# EAGLE design stm_adapters (EAGLE 7.4.0)
STM32 development boards
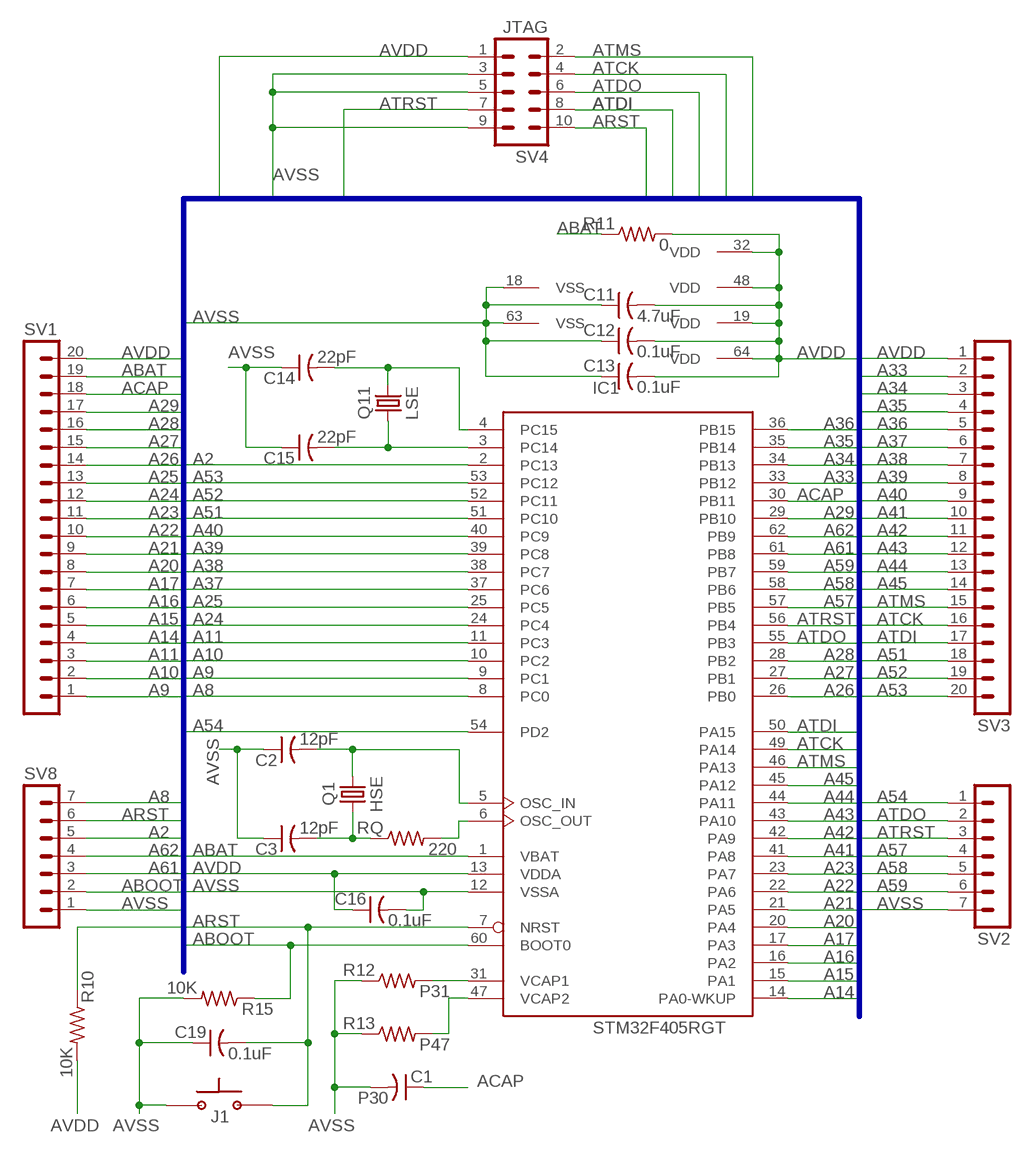
[diagram p0: schematic, sheet 1, part 1 of 2]
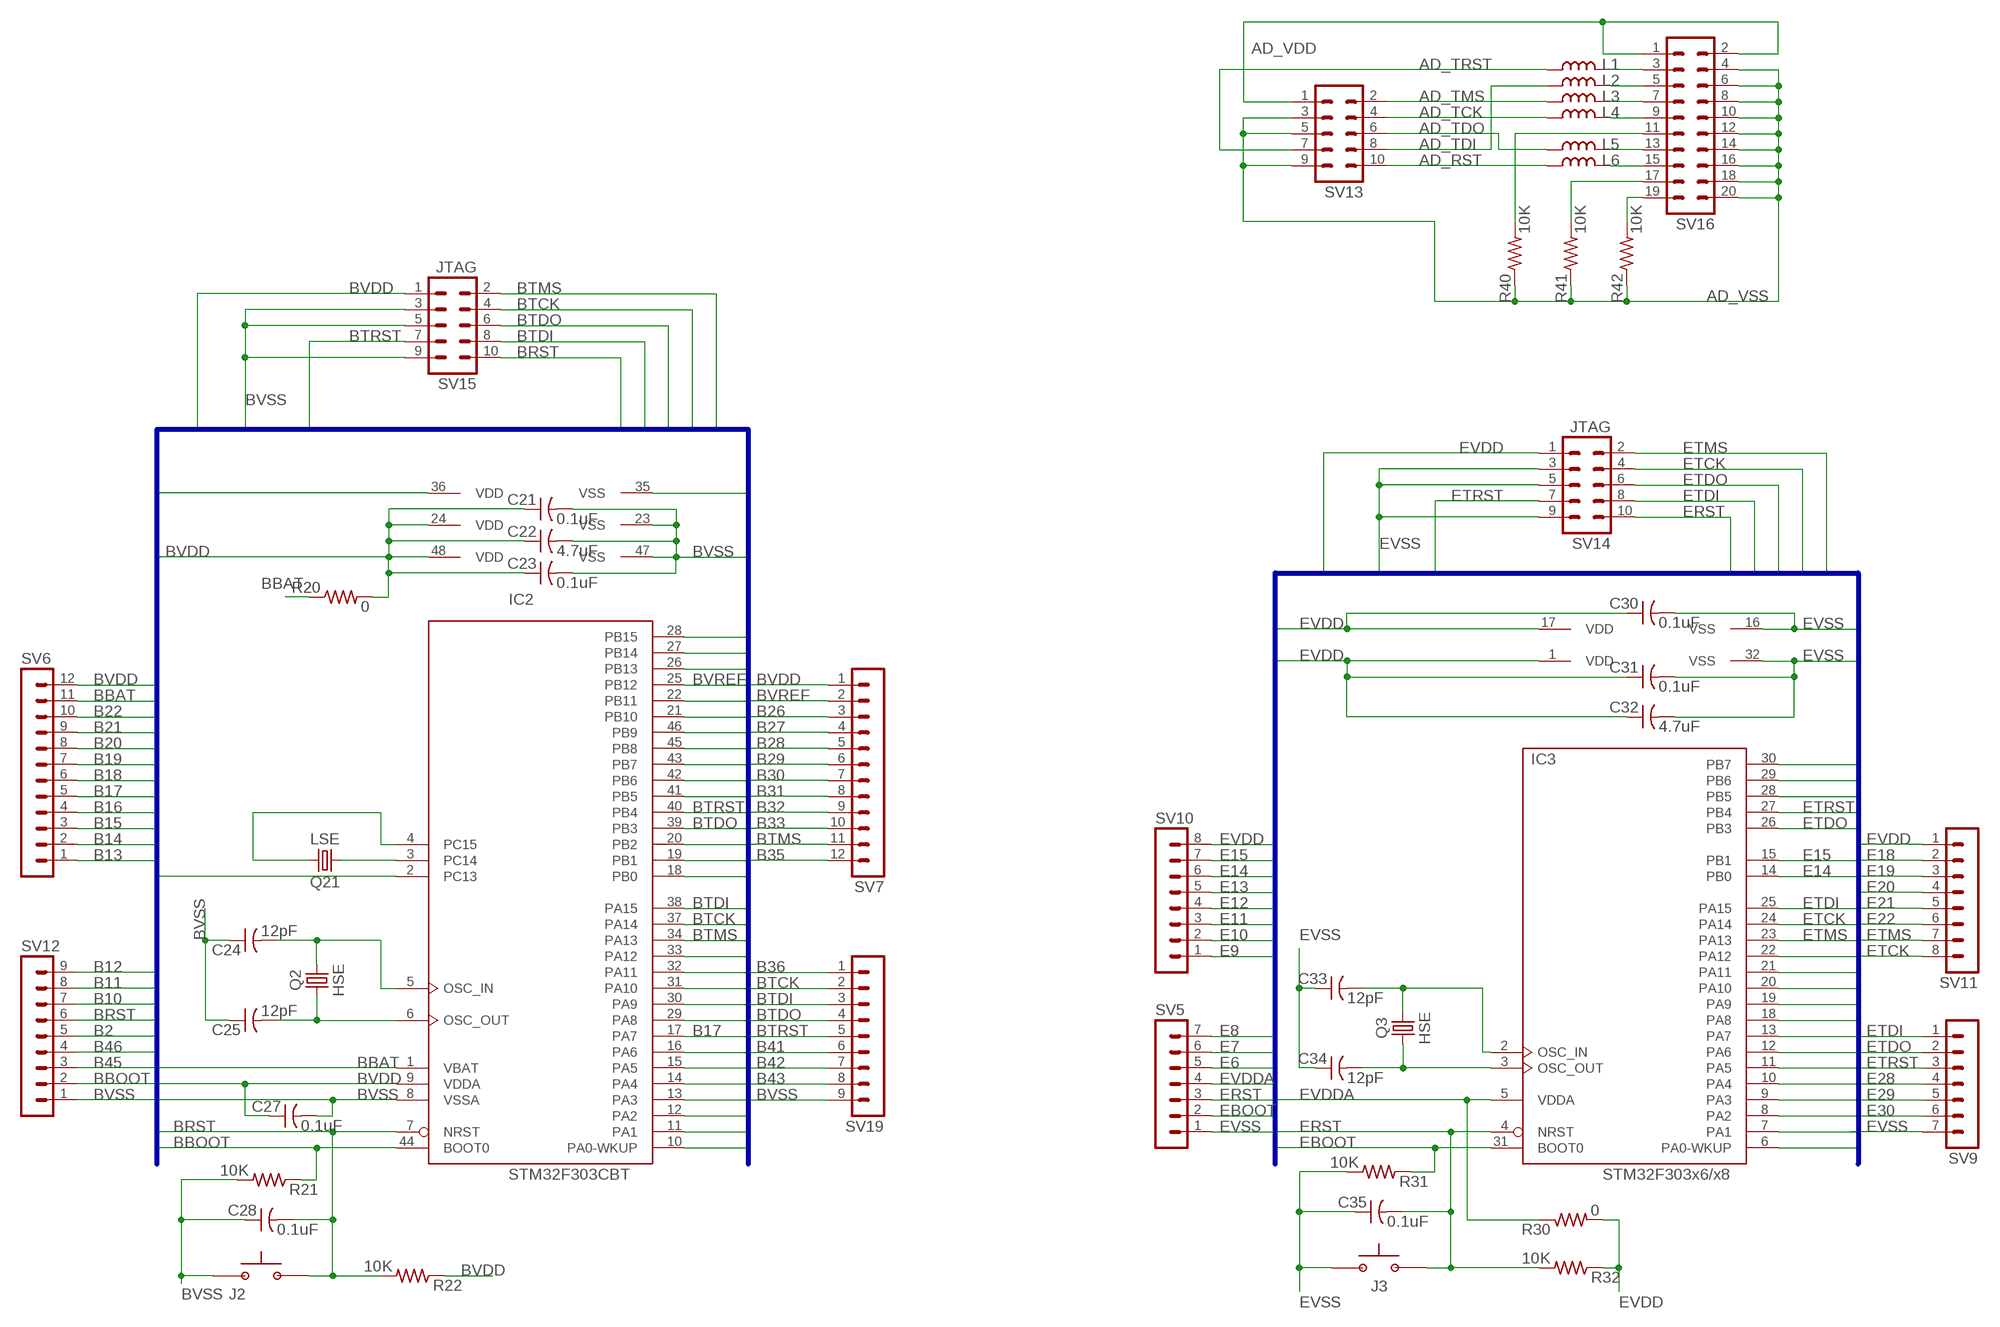
[diagram p1: schematic, sheet 1, part 2 of 2]

## Parts
C1  P30  C-US0805  [C0805]
C2  12pF  C-US0805  [C0805]
C3  12pF  C-US0805  [C0805]
C11  4.7uF  C-US0805  [C0805]
C12  0.1uF  C-US0805  [C0805]
C13  0.1uF  C-US0805  [C0805]
C14  22pF  C-US0805  [C0805]
C15  22pF  C-US0805  [C0805]
C16  0.1uF  C-US0805  [C0805]
C19  0.1uF  C-US0805  [C0805]
C21  0.1uF  C-US0805  [C0805]
C22  4.7uF  C-US0805  [C0805]
C23  0.1uF  C-US0805  [C0805]
C24  12pF  C-US0805  [C0805]
C25  12pF  C-US0805  [C0805]
C27  0.1uF  C-US0805  [C0805]
C28  0.1uF  C-US0805  [C0805]
C30  0.1uF  C-US0805  [C0805]
C31  0.1uF  C-US0805  [C0805]
C32  4.7uF  C-US0805  [C0805]
C33  12pF  C-US0805  [C0805]
C34  12pF  C-US0805  [C0805]
C35  0.1uF  C-US0805  [C0805]
IC1  STM32F405RGT  [LQFP64]
IC2  STM32F303CBT  [LQFP48]
IC3  STM32F303x6/x8  STM32F051K4T  [LQFP32]
J1  BUTTON-FSM14JRT  [BUTTON-FSM14JRT]
J2  BUTTON-FSM14JRT  [BUTTON-FSM14JRT]
J3  BUTTON-FSM14JRT  [BUTTON-FSM14JRT]
L1  L-USL0603  [L0603]
L2  L-USL0603  [L0603]
L3  L-USL0603  [L0603]
L4  L-USL0603  [L0603]
L5  L-USL0603  [L0603]
L6  L-USL0603  [L0603]
Q1  HSE  Q-HSEHC-46X  [Q-HC-46X]
Q2  HSE  Q-HSEHC-46X  [Q-HC-46X]
Q3  HSE  Q-HSEHC-46X  [Q-HC-46X]
Q11  LSE  Q-LSEMC-306  [Q-MC-306]
Q21  LSE  Q-LSEMC-306  [Q-MC-306]
R10  10K  R-US0805  [R0805]
R11  0  R-US0805  [R0805]
R12  P31  R-US0805  [R0805]
R13  P47  R-US0805  [R0805]
R15  10K  R-US0805  [R0805]
R20  0  R-US0805  [R0805]
R21  10K  R-US0805  [R0805]
R22  10K  R-US0805  [R0805]
R30  0  R-US0805  [R0805]
R31  10K  R-US0805  [R0805]
R32  10K  R-US0805  [R0805]
R40  10K  R-US0805  [R0805]
R41  10K  R-US0805  [R0805]
R42  10K  R-US0805  [R0805]
RQ  220  R-US0805  [R0805]
SV1  MA20-1NO-PL  [MA20-1-NO-PL]
SV2  MA07-1NO-PL  [MA07-1-NO-PL]
SV3  MA20-1NO-PL  [MA20-1-NO-PL]
SV4  JTAG  MA05-2  [MA05-2]
SV5  MA07-1NO-PL  [MA07-1-NO-PL]
SV6  MA12-1NO-PL  [MA12-1-NO-PL]
SV7  MA12-1NO-PL  [MA12-1-NO-PL]
SV8  MA07-1NO-PL  [MA07-1-NO-PL]
SV9  MA07-1NO-PL  [MA07-1-NO-PL]
SV10  MA08-1NO-PL  [MA08-1-NO-PL]
SV11  MA08-1NO-PL  [MA08-1-NO-PL]
SV12  MA09-1NO-PL  [MA09-1-NO-PL]
SV13  MA05-2  [MA05-2]
SV14  JTAG  MA05-2  [MA05-2]
SV15  JTAG  MA05-2  [MA05-2]
SV16  MA10-2  [MA10-2]
SV19  MA09-1NO-PL  [MA09-1-NO-PL]

## Nets
A2: IC1.2(PC13) SV8.5
A8: IC1.8(PC0) SV8.7
A9: IC1.9(PC1) SV1.1
A10: IC1.10(PC2) SV1.2
A11: IC1.11(PC3) SV1.3
A14: IC1.14(PA0-WKUP) SV1.4
A15: IC1.15(PA1) SV1.5
A16: IC1.16(PA2) SV1.6
A17: IC1.17(PA3) SV1.7
A20: IC1.20(PA4) SV1.8
A21: IC1.21(PA5) SV1.9
A22: IC1.22(PA6) SV1.10
A23: IC1.23(PA7) SV1.11
A24: IC1.24(PC4) SV1.12
A25: IC1.25(PC5) SV1.13
A26: IC1.26(PB0) SV1.14
A27: IC1.27(PB1) SV1.15
A28: IC1.28(PB2) SV1.16
A29: IC1.29(PB10) SV1.17
A33: IC1.33(PB12) SV3.2
A34: IC1.34(PB13) SV3.3
A35: IC1.35(PB14) SV3.4
A36: IC1.36(PB15) SV3.5
A37: IC1.37(PC6) SV3.6
A38: IC1.38(PC7) SV3.7
A39: IC1.39(PC8) SV3.8
A40: IC1.40(PC9) SV3.9
A41: IC1.41(PA8) SV3.10
A42: IC1.42(PA9) SV3.11
A43: IC1.43(PA10) SV3.12
A44: IC1.44(PA11) SV3.13
A45: IC1.45(PA12) SV3.14
A51: IC1.51(PC10) SV3.18
A52: IC1.52(PC11) SV3.19
A53: IC1.53(PC12) SV3.20
A54: IC1.54(PD2) SV2.1
A57: IC1.57(PB5) SV2.4
A58: IC1.58(PB6) SV2.5
A59: IC1.59(PB7) SV2.6
A61: IC1.61(PB8) SV8.3
A62: IC1.62(PB9) SV8.4
ABAT: IC1.1(VBAT) R11.1 SV1.19
ABOOT: IC1.60(BOOT0) R15.1 SV8.2
ACAP: C1.1 IC1.30(PB11) SV1.18
ACAP1: IC1.31(VCAP1) R12.2
ACAP2: IC1.47(VCAP2) R13.2
AD_RST: L6.1 SV13.10
AD_TCK: L4.1 SV13.4
AD_TDI: L2.1 SV13.8
AD_TDO: L5.1 SV13.6
AD_TMS: L3.1 SV13.2
AD_TRST: L1.1 SV13.7
AD_VDD: SV13.1 SV16.1 SV16.2
AD_VSS: R40.1 R41.1 R42.1 SV13.3 SV13.5 SV13.9 SV16.4 SV16.6 SV16.8 SV16.10 SV16.12 SV16.14 SV16.16 SV16.18 SV16.20
ARST: C19.2 IC1.7(NRST) J1.P$2 R10.1 SV4.10 SV8.6
ATCK: IC1.49(PA14) SV3.16 SV4.4
ATDI: IC1.50(PA15) SV3.17 SV4.8
ATDO: IC1.55(PB3) SV2.2 SV4.6
ATMS: IC1.46(PA13) SV3.15 SV4.2
ATRST: IC1.56(PB4) SV2.3 SV4.7
AVDD: C11.2 C12.2 C13.2 C16.1 IC1.13(VDDA) IC1.19(VDD) IC1.32(VDD) IC1.48(VDD) IC1.64(VDD) R10.2 R11.2 SV1.20 SV3.1 SV4.1
AVSS: C1.2 C2.1 C3.1 C11.1 C12.1 C13.1 C14.1 C15.1 C16.2 C19.1 IC1.12(VSSA) IC1.18(VSS) IC1.63(VSS) J1.P$1 R12.1 R13.1 R15.2 SV2.7 SV4.3 SV4.5 SV4.9 SV8.1
B2: IC2.2(PC13) SV12.5
B10: IC2.10(PA0-WKUP) SV12.7
B11: IC2.11(PA1) SV12.8
B12: IC2.12(PA2) SV12.9
B13: IC2.13(PA3) SV6.1
B14: IC2.14(PA4) SV6.2
B15: IC2.15(PA5) SV6.3
B16: IC2.16(PA6) SV6.4
B17: IC2.17(PA7) SV6.5
B18: IC2.18(PB0) SV6.6
B19: IC2.19(PB1) SV6.7
B20: IC2.20(PB2) SV6.8
B21: IC2.21(PB10) SV6.9
B22: IC2.22(PB11) SV6.10
B26: IC2.26(PB13) SV7.3
B27: IC2.27(PB14) SV7.4
B28: IC2.28(PB15) SV7.5
B29: IC2.29(PA8) SV7.6
B30: IC2.30(PA9) SV7.7
B31: IC2.31(PA10) SV7.8
B32: IC2.32(PA11) SV7.9
B33: IC2.33(PA12) SV7.10
B35: IC2.35(VSS) SV7.12
B36: IC2.36(VDD) SV19.1
B41: IC2.41(PB5) SV19.6
B42: IC2.42(PB6) SV19.7
B43: IC2.43(PB7) SV19.8
B45: IC2.45(PB8) SV12.3
B46: IC2.46(PB9) SV12.4
BBAT: IC2.1(VBAT) R20.1 SV6.11
BBOOT: IC2.44(BOOT0) R21.1 SV12.2
BRST: C28.2 IC2.7(NRST) J2.P$2 R22.2 SV12.6 SV15.10
BTCK: IC2.37(PA14) SV15.4 SV19.2
BTDI: IC2.38(PA15) SV15.8 SV19.3
BTDO: IC2.39(PB3) SV15.6 SV19.4
BTMS: IC2.34(PA13) SV7.11 SV15.2
BTRST: IC2.40(PB4) SV15.7 SV19.5
BVDD: C21.1 C22.1 C23.1 C27.1 IC2.9(VDDA) IC2.24(VDD) IC2.48(VDD) R20.2 R22.1 SV6.12 SV7.1 SV15.1
BVREF: IC2.25(PB12) SV7.2
BVSS: C21.2 C22.2 C23.2 C24.1 C25.1 C27.2 C28.1 IC2.8(VSSA) IC2.23(VSS) IC2.47(VSS) J2.P$1 R21.2 SV12.1 SV15.3 SV15.5 SV15.9 SV19.9
E6: IC3.6(PA0-WKUP) SV5.5
E7: IC3.7(PA1) SV5.6
E8: IC3.8(PA2) SV5.7
E9: IC3.9(PA3) SV10.1
E10: IC3.10(PA4) SV10.2
E11: IC3.11(PA5) SV10.3
E12: IC3.12(PA6) SV10.4
E13: IC3.13(PA7) SV10.5
E14: IC3.14(PB0) SV10.6
E15: IC3.15(PB1) SV10.7
E18: IC3.18(PA8) SV11.2
E19: IC3.19(PA9) SV11.3
E20: IC3.20(PA10) SV11.4
E21: IC3.21(PA11) SV11.5
E22: IC3.22(PA12) SV11.6
E28: IC3.28(PB5) SV9.4
E29: IC3.29(PB6) SV9.5
E30: IC3.30(PB7) SV9.6
EBOOT: IC3.31(BOOT0) R31.1 SV5.2
ERST: C35.2 IC3.4(NRST) J3.P$2 R32.2 SV5.3 SV14.10
ETCK: IC3.24(PA14) SV11.8 SV14.4
ETDI: IC3.25(PA15) SV9.1 SV14.8
ETDO: IC3.26(PB3) SV9.2 SV14.6
ETMS: IC3.23(PA13) SV11.7 SV14.2
ETRST: IC3.27(PB4) SV9.3 SV14.7
EVDD: C30.1 C31.1 C32.1 IC3.1(VDD) IC3.17(VDD) R30.2 R32.1 SV10.8 SV11.1 SV14.1
EVDDA: IC3.5(VDDA) R30.1 SV5.4
EVSS: C30.2 C31.2 C32.2 C33.1 C34.1 C35.1 IC3.16(VSS) IC3.32(VSS) J3.P$1 R31.2 SV5.1 SV9.7 SV14.3 SV14.5 SV14.9
N$4: R42.2 SV16.19
N$5: R41.2 SV16.17
N$6: R40.2 SV16.11
N$10: L6.2 SV16.15
N$11: L5.2 SV16.13
N$13: L4.2 SV16.9
N$17: C24.2 IC2.5(OSC_IN) Q2.1
N$22: C25.2 IC2.6(OSC_OUT) Q2.2
N$24: L3.2 SV16.7
N$26: IC2.3(PC14) Q21.1
N$27: IC2.4(PC15) Q21.4
N$29: L2.2 SV16.5
N$36: L1.2 SV16.3
N$39: C34.2 IC3.3(OSC_OUT) Q3.1
N$44: C33.2 IC3.2(OSC_IN) Q3.2
N$69: C15.2 IC1.3(PC14) Q11.1
N$70: C14.2 IC1.4(PC15) Q11.4
N$71: C2.2 IC1.5(OSC_IN) Q1.1
N$72: IC1.6(OSC_OUT) RQ.2
N$78: C3.2 Q1.2 RQ.1

## Buses
A
B
E

## Library data of the parts
C1-C3 C11-C16 C19 C21-C25 C27 C28 C30-C35 = MyComponents:C-US: SMD Multilayer Ceramic Capacitor; MOUSER: 80-C0805C104J5RAUTO
IC1 = stm32:STM32F405R*T: ARM 32-bit Cortex™-M3 CPU 168 MHz maximum frequency 1024 Kbytes of Flash memory 192 kbytes of SRAM 51 GPIOs 1.8 to 3.6 V application supply
IC2 = stm32:STM32F303C*T: ARM 32-bit Cortex™-M3 CPU 72 MHz maximum frequency 128 to 256 Kbytes of Flash memory 32 to 40 kbytes of SRAM 37 GPIOs 2.0 to 3.6 V application supply
IC3 = stm32:STM32F051K*T: ARM 32-bit Cortex™-M0 CPU 48 MHz maximum frequency 16 to 32 Kbytes of Flash memory 4 kbytes of SRAM 25 GPIOs 2.0 to 3.6 V application supply
J1-J3 = MyComponents:BUTTON-FSM14JRT: TE Connectivity / Alcoswitch Round Switch; MOUSER: 506-1571010-1
L1-L6 = MyComponents:L-US: SMD Ferrite Bead; MOUSER: 81-BLM11B421S
Q1-Q3 = MyComponents:Q-HSE: HSE SMD Crystal; MOUSER: 520-160-20-46X
Q11 Q21 = MyComponents:Q-LSE: 32.768 kHz SMD Crystal; MOUSER: 732-MC30632.7680KA0R
R10-R13 R15 R20-R22 R30-R32 R40-R42 RQ = MyComponents:R-US: SMD Resistor; MOUSER: 660-RK73H2ATTDD1R00F
SV1 SV3 = MyComponents:MA20-1: Headers & Wire Housing, 1 Row, 20 Position; MOUSER: 649-68000-420HLF
SV2 SV5 SV8 SV9 = MyComponents:MA07-1: Headers & Wire Housing, 1 Row, 7 Position
SV4 SV13-SV15 = MyComponents:MA05-2: Headers & Wire Housing, 2 Row, 10 Position
SV6 SV7 = MyComponents:MA12-1: Headers & Wire Housing, 1 Row, 12 Position
SV10 SV11 = MyComponents:MA08-1: Headers & Wire Housing, 1 Row, 8 Position
SV12 SV19 = MyComponents:MA09-1: Headers & Wire Housing, 1 Row, 9 Position
SV16 = MyComponents:MA10-2: Headers & Wire Housing, 2 Row, 20 Position; OC_FARNELL: unknown; OC_NEWARK: unknown

## Board
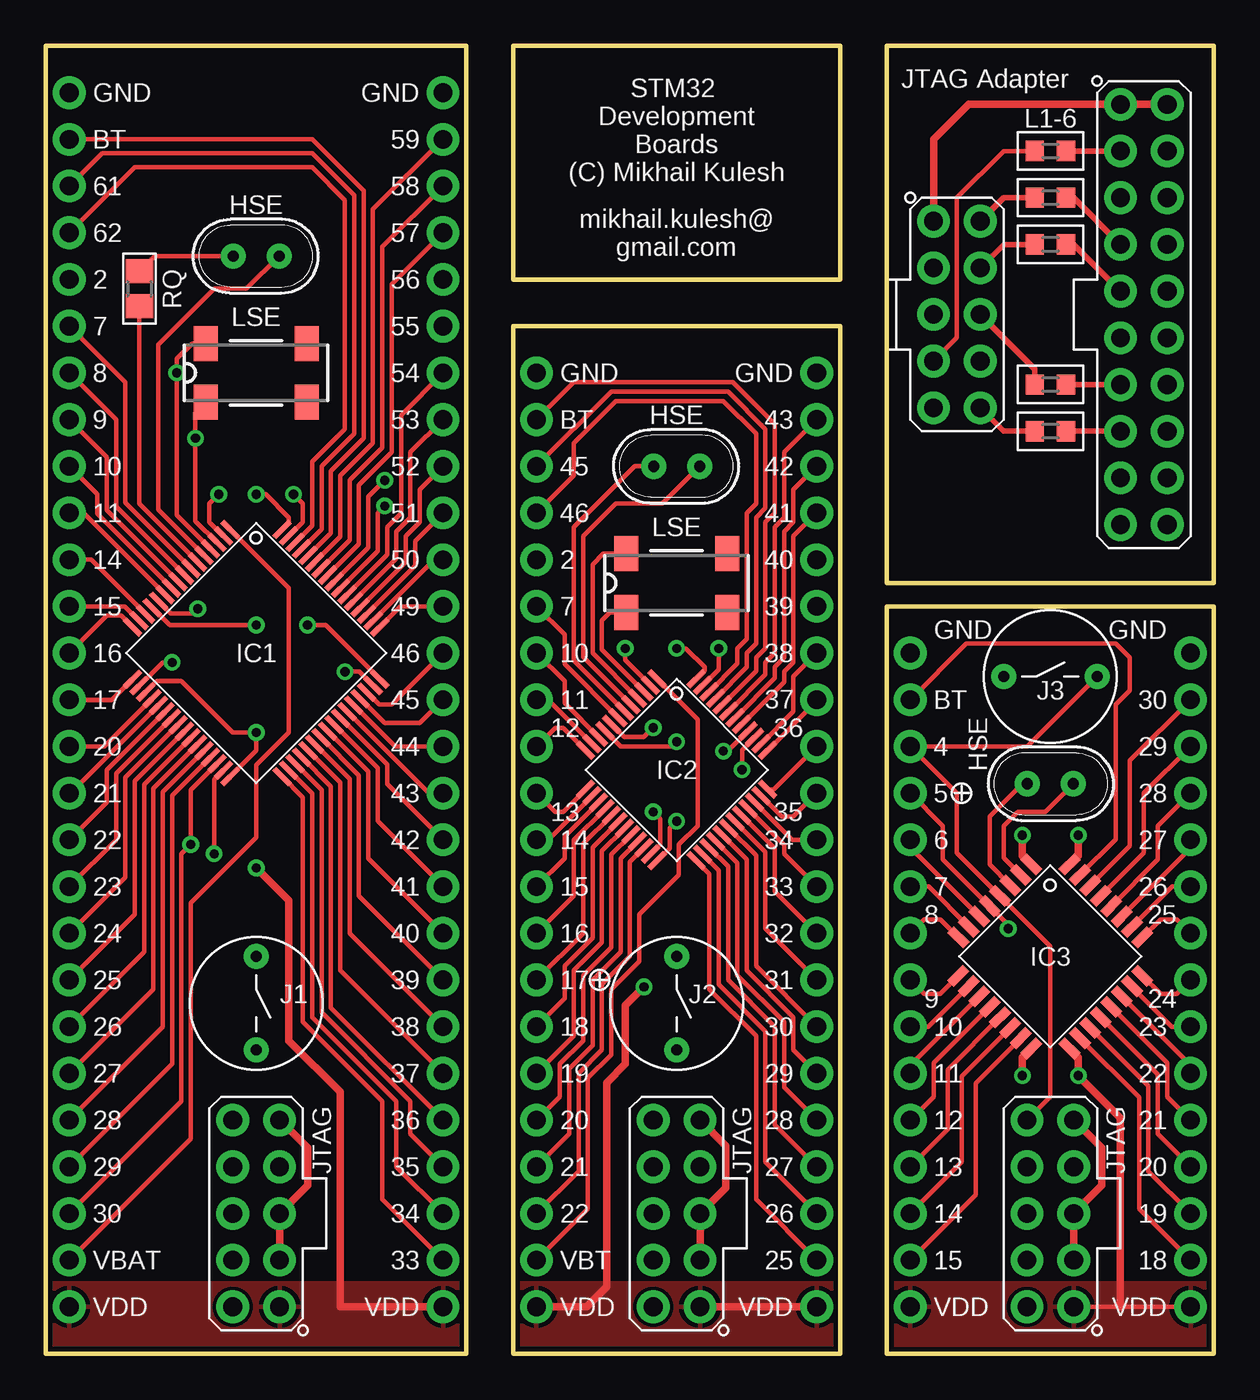
[diagram p2: board, top side]
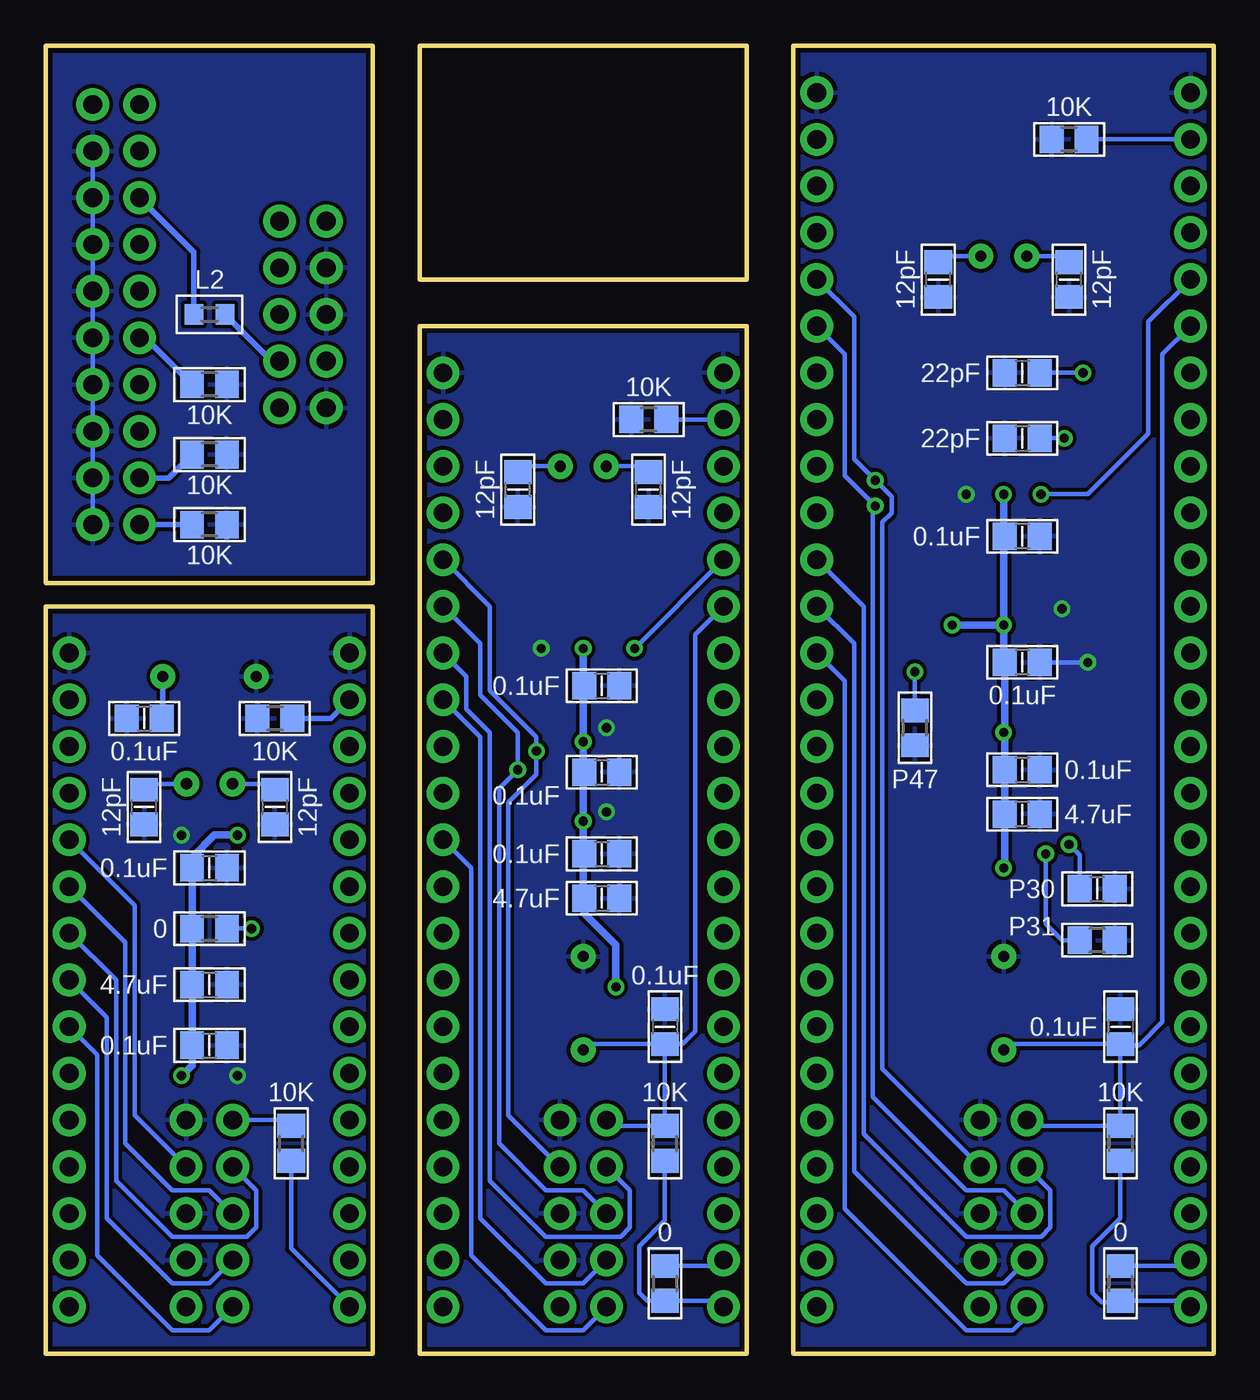
[diagram p3: board, bottom side, seen from below]

Size 63.5 x 71.12 mm. Coordinates in mm from the lower left corner, seen from the top.
Outline: 45.72,0 63.5,0 63.5,40.64 45.72,40.64 45.72,0
Outline: 45.72,41.91 63.5,41.91 63.5,71.12 45.72,71.12 45.72,41.91
Outline: 25.4,55.88 43.18,55.88 43.18,0 25.4,0 25.4,55.88
Outline: 0,71.12 22.86,71.12 22.86,0 0,0 0,71.12
Outline: 25.4,58.42 43.18,58.42 43.18,71.12 25.4,71.12 25.4,58.42
Copper layers (1*16): Top 0.035mm / dielectric 1.5mm / Bottom 0.035mm
Design rules "eagle": minimum track width 10mil, minimum drill 19mil, track to track 8mil, track to pad 8mil, pad to pad 7mil, via to via 12mil, smd to smd 7mil, copper to edge 10mil, drill to drill 30mil, minimum pad ring 15mil, minimum via ring 8mil, stop-mask expansion 4mil, vias tented up to drill 0mil, thermal gap 10mil

### Footprints (pad centres in the part's own frame; a part is rotated, then mirrored left to right if it is on the bottom)
C0805 = smd 1.3 x 1.5: 1 -0.95,0; 2 0.95,0
LQFP64 = smd 0.3 x 1.2: 1 -3.75,-5.75; 2 -3.25,-5.75; 3 -2.75,-5.75; 4 -2.25,-5.75; 5 -1.75,-5.75; 6 -1.25,-5.75; 7 -0.75,-5.75; 8 -0.25,-5.75; 9 0.25,-5.75; 10 0.75,-5.75; 11 1.25,-5.75; 12 1.75,-5.75; 13 2.25,-5.75; 14 2.75,-5.75; 15 3.25,-5.75; 16 3.75,-5.75; 33 3.75,5.75; 34 3.25,5.75; 35 2.75,5.75; 36 2.25,5.75; 37 1.75,5.75; 38 1.25,5.75; 39 0.75,5.75; 40 0.25,5.75; 41 -0.25,5.75; 42 -0.75,5.75; 43 -1.25,5.75; 44 -1.75,5.75; 45 -2.25,5.75; 46 -2.75,5.75; 47 -3.25,5.75; 48 -3.75,5.75 | smd 1.2 x 0.3: 17 5.75,-3.75; 18 5.75,-3.25; 19 5.75,-2.75; 20 5.75,-2.25; 21 5.75,-1.75; 22 5.75,-1.25; 23 5.75,-0.75; 24 5.75,-0.25; 25 5.75,0.25; 26 5.75,0.75; 27 5.75,1.25; 28 5.75,1.75; 29 5.75,2.25; 30 5.75,2.75; 31 5.75,3.25; 32 5.75,3.75; 49 -5.75,3.75; 50 -5.75,3.25; 51 -5.75,2.75; 52 -5.75,2.25; 53 -5.75,1.75; 54 -5.75,1.25; 55 -5.75,0.75; 56 -5.75,0.25; 57 -5.75,-0.25; 58 -5.75,-0.75; 59 -5.75,-1.25; 60 -5.75,-1.75; 61 -5.75,-2.25; 62 -5.75,-2.75; 63 -5.75,-3.25; 64 -5.75,-3.75
LQFP48 = smd 0.3 x 1.2: 1 -2.75,-4.25; 2 -2.25,-4.25; 3 -1.75,-4.25; 4 -1.25,-4.25; 5 -0.75,-4.25; 6 -0.25,-4.25; 7 0.25,-4.25; 8 0.75,-4.25; 9 1.25,-4.25; 10 1.75,-4.25; 11 2.25,-4.25; 12 2.75,-4.25; 25 2.75,4.25; 26 2.25,4.25; 27 1.75,4.25; 28 1.25,4.25; 29 0.75,4.25; 30 0.25,4.25; 31 -0.25,4.25; 32 -0.75,4.25; 33 -1.25,4.25; 34 -1.75,4.25; 35 -2.25,4.25; 36 -2.75,4.25 | smd 1.2 x 0.3: 13 4.25,-2.75; 14 4.25,-2.25; 15 4.25,-1.75; 16 4.25,-1.25; 17 4.25,-0.75; 18 4.25,-0.25; 19 4.25,0.25; 20 4.25,0.75; 21 4.25,1.25; 22 4.25,1.75; 23 4.25,2.25; 24 4.25,2.75; 37 -4.25,2.75; 38 -4.25,2.25; 39 -4.25,1.75; 40 -4.25,1.25; 41 -4.25,0.75; 42 -4.25,0.25; 43 -4.25,-0.25; 44 -4.25,-0.75; 45 -4.25,-1.25; 46 -4.25,-1.75; 47 -4.25,-2.25; 48 -4.25,-2.75
LQFP32 = smd 0.5 x 1.2: 1 -2.8,-4.275; 2 -2,-4.275; 3 -1.2,-4.275; 4 -0.4,-4.275; 5 0.4,-4.275; 6 1.19,-4.275; 7 1.99,-4.275; 8 2.79,-4.275; 17 2.8,4.275; 18 2,4.275; 19 1.2,4.275; 20 0.4,4.275; 21 -0.4,4.275; 22 -1.2,4.275; 23 -2,4.275; 24 -2.8,4.275 | smd 1.2 x 0.5: 9 4.275,-2.8; 10 4.275,-2; 11 4.275,-1.2; 12 4.275,-0.4; 13 4.275,0.4; 14 4.275,1.2; 15 4.275,2; 16 4.275,2.8; 25 -4.275,2.8; 26 -4.275,2; 27 -4.275,1.2; 28 -4.275,0.4; 29 -4.275,-0.4; 30 -4.275,-1.2; 31 -4.275,-2; 32 -4.275,-2.8
BUTTON-FSM14JRT = drill 0.6: P$1 -2.54,0; P$2 2.54,0
L0603 = smd 1 x 1.1: 1 -0.85,0; 2 0.85,0
Q-HC-46X = drill 0.61: 1 -1.25,0; 2 1.25,0
Q-MC-306 = smd 1.3 x 1.9: 1 -2.75,-1.6; 2 2.75,-1.6; 3 2.75,1.6; 4 -2.75,1.6
R0805 = smd 1.3 x 1.5: 1 -0.95,0; 2 0.95,0
MA20-1-NO-PL = drill 1.016: 1 -24.13,0; 2 -21.59,0; 3 -19.05,0; 4 -16.51,0; 5 -13.97,0; 6 -11.43,0; 7 -8.89,0; 8 -6.35,0; 9 -3.81,0; 10 -1.27,0; 11 1.27,0; 12 3.81,0; 13 6.35,0; 14 8.89,0; 15 11.43,0; 16 13.97,0; 17 16.51,0; 18 19.05,0; 19 21.59,0; 20 24.13,0
MA07-1-NO-PL = drill 1.016: 1 -7.62,0; 2 -5.08,0; 3 -2.54,0; 4 0,0; 5 2.54,0; 6 5.08,0; 7 7.62,0
MA05-2 = drill 1.016: 1 -5.08,-1.27; 2 -5.08,1.27; 3 -2.54,-1.27; 4 -2.54,1.27; 5 0,-1.27; 6 0,1.27; 7 2.54,-1.27; 8 2.54,1.27; 9 5.08,-1.27; 10 5.08,1.27
MA12-1-NO-PL = drill 1.016: 1 -13.97,0; 2 -11.43,0; 3 -8.89,0; 4 -6.35,0; 5 -3.81,0; 6 -1.27,0; 7 1.27,0; 8 3.81,0; 9 6.35,0; 10 8.89,0; 11 11.43,0; 12 13.97,0
MA08-1-NO-PL = drill 1.016: 1 -8.89,0; 2 -6.35,0; 3 -3.81,0; 4 -1.27,0; 5 1.27,0; 6 3.81,0; 7 6.35,0; 8 8.89,0
MA09-1-NO-PL = drill 1.016: 1 -10.16,0; 2 -7.62,0; 3 -5.08,0; 4 -2.54,0; 5 0,0; 6 2.54,0; 7 5.08,0; 8 7.62,0; 9 10.16,0
MA10-2 = drill 1.016: 1 -11.43,-1.27; 2 -11.43,1.27; 3 -8.89,-1.27; 4 -8.89,1.27; 5 -6.35,-1.27; 6 -6.35,1.27; 7 -3.81,-1.27; 8 -3.81,1.27; 9 -1.27,-1.27; 10 -1.27,1.27; 11 1.27,-1.27; 12 1.27,1.27; 13 3.81,-1.27; 14 3.81,1.27; 15 6.35,-1.27; 16 6.35,1.27; 17 8.89,-1.27; 18 8.89,1.27; 19 11.43,-1.27; 20 11.43,1.27

### Placement (x,y rotation side)
C1  6.35,25.27 0 bottom
C2  14.99,58.42 90 bottom
C3  7.87,58.42 90 bottom
C11  10.41,29.34 180 bottom
C12  10.41,44.45 180 bottom
C13  10.41,37.59 180 bottom
C14  10.41,53.34 0 bottom
C15  10.41,49.78 0 bottom
C16  10.41,31.75 0 bottom
C19  5.08,17.78 270 bottom
C21  33.27,27.18 0 bottom
C22  33.27,24.77 0 bottom
C23  33.27,36.32 0 bottom
C24  37.85,46.99 90 bottom
C25  30.73,46.99 90 bottom
C27  33.27,31.62 0 bottom
C28  29.84,17.78 270 bottom
C30  54.61,16.76 0 bottom
C31  54.61,26.42 0 bottom
C32  54.61,20.07 0 bottom
C33  58.17,29.72 90 bottom
C34  51.05,29.72 90 bottom
C35  58.17,34.54 0 bottom
IC1  11.43,38.1 225 top
IC2  34.29,31.75 225 top
IC3  54.61,21.59 225 top
J1  11.43,19.05 270 top
J2  34.29,19.05 270 top
J3  54.61,36.83 0 top
L1  54.61,65.41 0 top
L2  54.61,56.52 180 bottom
L3  54.61,62.87 0 top
L4  54.61,60.33 0 top
L5  54.61,52.7 0 top
L6  54.61,50.16 0 top
Q1  11.43,59.69 180 top
Q2  34.29,48.26 180 top
Q3  54.61,30.99 0 top
Q11  11.43,53.34 0 top
Q21  34.29,41.91 0 top
R10  5.08,11.43 270 bottom
R11  5.08,3.81 270 bottom
R12  6.35,22.48 180 bottom
R13  16.26,34.04 90 bottom
R15  7.87,66.04 180 bottom
R20  29.84,3.81 270 bottom
R21  30.73,50.8 180 bottom
R22  29.84,11.43 90 bottom
R30  54.61,23.11 180 bottom
R31  51.05,34.54 180 bottom
R32  50.16,11.43 90 bottom
R40  54.61,52.7 180 bottom
R41  54.61,48.9 180 bottom
R42  54.61,45.09 180 bottom
RQ  5.08,57.91 270 top
SV1  1.27,26.67 270 bottom
SV2  21.59,60.96 90 bottom
SV3  21.59,26.67 90 bottom
SV4  11.43,7.62 90 top
SV5  46.99,30.48 270 bottom
SV6  26.67,16.51 270 bottom
SV7  41.91,16.51 90 bottom
SV8  1.27,60.96 270 bottom
SV9  62.23,30.48 90 bottom
SV10  46.99,11.43 270 bottom
SV11  62.23,11.43 90 bottom
SV12  26.67,43.18 270 bottom
SV13  49.53,56.52 270 top
SV14  54.61,7.62 90 top
SV15  34.29,7.62 90 top
SV16  59.69,56.52 270 top
SV19  41.91,43.18 90 bottom

### Tracks (layer width: path | path; a pad name or v marks a point on that pad's centre or on a via)
A2  (via drill 0.5)
  Top 0.254: IC1.2 8.89,45.24 8.89,46.23 v9.4,46.74
  Bottom 0.254: SV8.5 3.56,56.13 3.56,50.04 6.86,46.74 v9.4,46.74
A8
  Top 0.254: IC1.8 3.81,46.07 3.81,50.8 SV8.7
A9
  Top 0.254: IC1.9 3.3,45.87 3.3,48.77 SV1.1
A10
  Top 0.254: IC1.10 2.79,45.67 2.79,46.74 SV1.2
A11
  Top 0.254: IC1.11 2.04,45.72 SV1.3
A14
  Top 0.254: IC1.14 2.46,43.18 SV1.4
A15
  Top 0.254: IC1.15 4.29,40.64 SV1.5
A16
  Top 0.254: IC1.16 4.09,40.13 3.3,40.13 SV1.6
A17
  Top 0.254: IC1.17 3.59,35.56 SV1.7
A20
  Top 0.254: SV1.8 3.17,33.02 IC1.20
A21
  Top 0.254: IC1.21 1.33,30.48 SV1.9
A22
  Top 0.254: SV1.10 3.3,29.97 3.3,31.74 IC1.22
A23
  Top 0.254: SV1.11 3.81,27.94 3.81,31.54 IC1.23
A24
  Top 0.254: SV1.12 4.32,25.91 4.32,31.34 IC1.24
A25
  Top 0.254: SV1.13 4.83,23.88 4.83,31.14 IC1.25
A26
  Top 0.254: SV1.14 5.33,21.84 5.33,30.94 IC1.26
A27
  Top 0.254: SV1.15 5.84,19.81 5.84,30.74 IC1.27
A28
  Top 0.254: SV1.16 6.35,17.78 6.35,30.55 IC1.28
A29
  Top 0.254: SV1.17 6.86,15.75 6.86,30.35 IC1.29
A33
  Top 0.254: IC1.33 13.97,30.26 13.97,18.03 18.29,13.72 18.29,8.38 SV3.2
A34
  Top 0.254: SV3.3 19.05,10.16 19.05,13.72 14.48,18.29 14.48,30.46 IC1.34
A35
  Top 0.254: SV3.4 19.81,11.94 19.81,13.72 14.99,18.54 14.99,30.66 IC1.35
A36
  Top 0.254: SV3.5 15.49,18.8 15.49,30.85 IC1.36
A37
  Top 0.254: SV3.6 16,20.83 16,31.05 IC1.37
A38
  Top 0.254: SV3.7 16.51,22.86 16.51,31.25 IC1.38
A39
  Top 0.254: SV3.8 17.02,24.89 17.02,31.45 IC1.39
A40
  Top 0.254: SV3.9 17.53,26.92 17.53,31.65 IC1.40
A41
  Top 0.254: SV3.10 18.03,28.96 18.03,31.85 IC1.41
A42
  Top 0.254: SV3.11 18.54,30.99 18.54,32.05 IC1.42
A43
  Top 0.254: IC1.43 20.82,30.48 SV3.12
A44
  Top 0.254: IC1.44 18.98,33.02 SV3.13
A45
  Top 0.254: IC1.45 18.42,34.29 20.32,34.29 SV3.14
A51
  Top 0.254: IC1.51 20.07,42.85 20.07,44.2 SV3.18
A52
  Top 0.254: IC1.52 19.56,43.05 19.56,44.45 20.32,45.21 20.32,46.99 SV3.19
A53
  Top 0.254: IC1.53 19.05,43.24 19.05,44.7 19.81,45.47 19.81,49.02 SV3.20
A54
  Top 0.254: IC1.54 18.54,43.44 18.54,44.96 19.3,45.72 19.3,51.05 SV2.1
A57
  Top 0.254: IC1.57 17.02,44.04 17.02,47.24 18.8,49.02 18.8,58.17 SV2.4
A58
  Top 0.254: IC1.58 16.51,44.24 16.51,47.5 18.29,49.28 18.29,60.2 SV2.5
A59
  Top 0.254: IC1.59 16,44.44 16,47.75 17.78,49.53 17.78,62.23 SV2.6
A61
  Top 0.254: IC1.61 14.99,44.84 14.99,48.26 16.76,50.04 16.76,62.99 14.48,65.28 3.05,65.28 SV8.3
A62
  Top 0.254: IC1.62 14.48,45.04 14.48,48.51 16.26,50.29 16.26,62.74 14.48,64.52 4.83,64.52 SV8.4
ABAT
  Top 0.254: IC1.1 13.21,41.62 13.21,33.78 11.43,32 11.43,28.07 7.87,24.51 7.87,11.68 SV1.19
  Bottom 0.254: R11.1 1.59,4.76 SV1.19
ABOOT
  Top 0.254: IC1.60 15.49,44.64 15.49,48.01 17.27,49.78 17.27,63.25 14.48,66.04 SV8.2
  Bottom 0.254: R15.1 SV8.2
ACAP  (via drill 0.5)
  Top 0.254: SV1.18 7.37,13.72 7.37,27.18 v7.87,27.69 7.87,30.66 IC1.30
  Bottom 0.254: C1.1 7.3,27.11 v7.87,27.69
ACAP1  (via drill 0.5)
  Top 0.254: IC1.31 9.14,31.22 v9.14,27.18
  Bottom 0.254: R12.2 8.26,22.48 9.14,23.37 v9.14,27.18
ACAP2  (via drill 0.5)
  Top 0.254: IC1.47 17.04,37.08 v16.26,37.08
  Bottom 0.254: R13.2 v16.26,37.08
AD_RST
  Top 0.305: SV13.10 52.07,50.16 L6.1
AD_TCK
  Top 0.305: SV13.4 52.07,60.33 L4.1
AD_TDI
  Bottom 0.305: SV13.8 51.22,53.98 L2.1
AD_TDO
  Top 0.305: SV13.6 53.76,53.55 L5.1
AD_TMS
  Top 0.305: SV13.2 52.07,62.87 L3.1
AD_TRST
  Top 0.254: SV13.7 49.53,55.24 49.53,62.87 52.07,65.41 L1.1
AD_VDD
  Top 0.406: SV13.1 48.26,66.04 50.16,67.94 SV16.1 SV16.2
AD_VSS
  Bottom 0.254: SV16.4 SV16.6 SV16.8 SV16.10 SV16.12 SV16.14 SV16.16 SV16.18 SV16.20
  pour Bottom: 45.72,71.12 45.72,41.91 63.5,41.91 63.5,71.12
ARST
  Top 0.254: IC1.7 4.32,46.27 4.32,52.83 SV8.6
  Bottom 0.254: SV8.6 2.79,54.36 2.79,18.03 4.06,16.76 5.01,16.76 C19.2 | J1.P$2 11.11,16.83 C19.2 | C19.2 R10.1 9.84,12.38 SV4.10
ATCK
  Top 0.254: IC1.49 19.27,40.64 SV3.16
  Bottom 0.254: SV4.4 11.43,3.81 13.46,3.81 19.56,9.91 19.56,38.61 SV3.16
ATDI
  Top 0.254: IC1.50 21.11,43.18 SV3.17
  Bottom 0.254: SV4.8 8.89,8.89 8.89,6.86 9.4,6.35 13.46,6.35 19.05,11.94 19.05,40.64 SV3.17
ATDO  (via drill 0.5)
  Top 0.254: IC1.55 18.03,43.64 18.03,45.72 v18.41,46.1
  Bottom 0.254: SV4.6 11.43,8.89 13.46,8.89 18.54,13.97 18.54,45.97 v18.41,46.1 20.07,47.75 20.07,54.36 SV2.2
ATMS
  Top 0.254: IC1.46 18.11,35.31 18.8,35.31 SV3.15
  Bottom 0.254: SV4.2 10.16,2.03 10.92,1.27 13.46,1.27 20.07,7.87 20.07,36.58 SV3.15
ATRST  (via drill 0.5)
  Top 0.254: IC1.56 17.53,43.84 17.53,46.61 v18.41,47.5
  Bottom 0.254: SV2.3 19.56,56.39 19.56,48.64 v18.41,47.5 17.53,46.61 17.53,45.72 18.03,45.21 18.03,15.49 SV4.7
AVDD  (via drill 0.5)
  Top 0.254: IC1.32 11.43,32.8 v11.43,33.78 10.16,33.78 7.37,36.58 6.02,36.58 IC1.19 | IC1.13 6.72,39.62 v11.43,39.62 | IC1.64 13.21,45.18 13.21,45.47 11.94,46.74 v11.43,46.74 | IC1.48 15.21,39.62 v14.22,39.62
  Top 0.406: v11.43,26.42 13.21,24.64 13.21,17.02 16,14.22 16,2.54 SV3.1
  Bottom 0.254: SV1.20 1.59,2.86 R11.2 5.15,2.79 6.1,2.79 6.6,3.3 6.6,5.84 5.08,7.37 R10.2
  Bottom 0.406: v11.43,26.42 11.36,26.48 C11.2 C16.1 | C16.1 11.43,31.82 | C16.1 11.36,33.72 arc-90 v11.43,33.78 11.36,33.85 C13.2 11.43,37.66 v11.43,39.62 | v11.43,39.62 11.43,44.38 C12.2 11.43,44.52 v11.43,46.74 | v14.22,39.62 v11.43,39.62
  pour Top: 0,3.81 22.86,3.81 22.86,0 0,0
AVSS  (via drill 0.5)
  Top 0.254: IC1.18 5.09,36.33 6.35,37.59 v6.86,37.59 | IC1.12 6.8,40.26 8,40.26 v8.26,40.51 | IC1.63 13.97,45.24 13.97,46.23 v13.46,46.74
  Top 0.406: SV4.9 14.22,11.18 14.22,9.14 SV4.5 SV4.3
  Bottom 0.254: v6.86,37.59 C13.1
  pour Bottom: 0,71.12 22.86,71.12 22.86,0 0,0
B2  (via drill 0.5)
  Top 0.254: IC2.2 31.5,37.73 v31.5,38.35
  Bottom 0.254: SV12.5 v31.5,38.35
B10
  Top 0.254: IC2.10 28.19,35.37 28.19,36.58 SV12.7
B11
  Top 0.254: IC2.11 27.3,35.56 SV12.8
B12
  Top 0.254: IC2.12 28.11,34.04 27.69,34.04 SV12.9
B13
  Top 0.254: IC2.13 28.11,29.46 27.69,29.46 SV6.1
B14
  Top 0.254: IC2.14 27.3,27.94 SV6.2
B15
  Top 0.254: IC2.15 28.19,28.13 28.19,26.92 SV6.3
B16
  Top 0.254: SV6.4 28.7,24.89 28.7,27.93 IC2.16
B17
  Top 0.254: SV6.5 29.21,22.86 29.21,27.73 IC2.17
B18
  Top 0.254: IC2.18 29.72,27.53 29.72,22.61 28.19,21.08 28.19,19.3 SV6.6
B19
  Top 0.254: IC2.19 30.23,27.33 30.23,22.35 28.7,20.83 28.7,17.27 SV6.7
B20
  Top 0.254: IC2.20 30.73,27.13 30.73,22.1 29.21,20.57 29.21,17.02 27.94,15.75 27.94,13.97 SV6.8
B21
  Top 0.254: IC2.21 31.24,26.93 31.24,21.84 29.72,20.32 29.72,16.76 28.45,15.49 28.45,11.94 SV6.9
B22
  Top 0.254: IC2.22 31.75,26.73 31.75,21.59 30.23,20.07 30.23,16.51 28.96,15.24 28.96,9.91 SV6.10
B26
  Top 0.254: SV7.3 39.12,10.41 39.12,17.53 36.58,20.07 36.58,26.28 IC2.26
B27
  Top 0.254: SV7.4 39.62,12.45 39.62,17.78 37.08,20.32 37.08,26.48 IC2.27
B28
  Top 0.254: SV7.5 40.13,14.48 40.13,18.03 37.59,20.57 37.59,26.68 IC2.28
B29
  Top 0.254: IC2.29 38.1,26.88 38.1,20.83 40.64,18.29 40.64,16.51 SV7.6
B30
  Top 0.254: IC2.30 38.61,27.08 38.61,21.08 SV7.7
B31
  Top 0.254: SV7.8 39.12,23.11 39.12,27.28 IC2.31
B32
  Top 0.254: SV7.9 39.62,25.15 39.62,27.48 IC2.32
B33
  Top 0.254: IC2.33 40.13,27.68 40.13,27.18 SV7.10
B35
  Top 0.254: IC2.35 40.01,29.21 40.64,29.21 SV7.12
B36
  Top 0.254: SV19.1 39.58,30.69 IC2.36
B41
  Top 0.254: IC2.41 40.13,36.53 40.13,37.08 40.64,37.59 40.64,44.45 SV19.6
B42
  Top 0.254: IC2.42 39.62,36.73 39.62,37.34 40.13,37.85 40.13,44.7 40.64,45.21 40.64,46.99 SV19.7
B43
  Top 0.254: IC2.43 39.12,36.93 39.12,37.59 39.62,38.1 39.62,44.96 40.13,45.47 40.13,49.02 SV19.8
B45
  Top 0.254: IC2.45 38.1,37.33 38.1,38.1 38.61,38.61 38.61,45.47 39.12,45.97 39.12,50.29 37.08,52.32 30.73,52.32 SV12.3
B46
  Top 0.254: IC2.46 37.59,37.53 37.59,38.35 38.1,38.86 38.1,45.72 38.61,46.23 38.61,50.04 36.83,51.82 30.99,51.82 28.7,49.53 28.7,47.75 SV12.4
BBAT
  Top 0.254: IC2.1 35.43,34.5 35.43,28.7 34.42,27.69 34.42,26.04 32.26,23.88 32.26,21.34 30.73,19.81 30.73,16.26 29.46,14.99 29.46,7.87 SV6.11
  Bottom 0.254: R20.1 26.99,4.76 SV6.11
BBOOT
  Top 0.254: IC2.44 38.61,37.13 38.61,37.85 39.12,38.35 39.12,45.21 39.62,45.72 39.62,50.55 37.34,52.83 28.7,52.83 SV12.2
  Bottom 0.254: R21.1 SV12.2
BRST
  Top 0.254: IC2.7 28.19,37.49 28.19,39.12 SV12.6
  Bottom 0.254: 34.22,16.58 J2.P$2 33.97,16.83 C28.2 | SV12.6 28.19,39.12 28.19,17.53 28.89,16.83 C28.2 | 30.1,12.63 arc90 R22.2 | C28.2 R22.2 | SV15.10 32.7,12.38 R22.2
BTCK
  Top 0.254: IC2.37 41.91,35.48 SV19.2
  Bottom 0.254: SV15.4 34.29,3.81 36.32,3.81 39.88,7.37 39.88,33.53 SV19.2
BTDI
  Top 0.254: IC2.38 40.64,34.92 40.64,36.83 SV19.3
  Bottom 0.254: SV15.8 31.75,8.89 31.75,6.86 32.26,6.35 36.32,6.35 39.37,9.4 39.37,33.78 40.64,35.05 40.64,36.83 SV19.3
BTDO  (via drill 0.5)
  Top 0.254: IC2.39 37.85,32.83 v37.85,31.75
  Bottom 0.254: SV15.6 34.29,8.89 36.32,8.89 38.86,11.43 38.86,30.73 v37.85,31.75 37.85,33.78 39.88,35.81 39.88,38.61 SV19.4
BTMS
  Top 0.254: IC2.34 40.58,27.94 SV7.11
  Bottom 0.254: SV7.11 40.39,26.42 40.39,5.33 36.32,1.27 34.29,1.27 SV15.2
BTRST  (via drill 0.5)
  Top 0.254: v36.83,32.77 37.07,32.77 IC2.40
  Bottom 0.254: SV15.7 38.35,12.95 38.35,29.97 36.83,31.5 v36.83,32.77 36.83,33.53 39.37,36.07 39.37,40.64 SV19.5
BVDD  (via drill 0.5)
  Top 0.254: IC2.9 31.25,33.02 34.04,33.02 v34.29,33.27 | IC2.24 33.91,27.48 33.91,28.57 v34.29,28.96 | IC2.48 35.81,37.16 35.81,37.34 34.8,38.35 v34.29,38.35
  Top 0.406: SV15.1 SV7.1 | SV6.12 29.4,2.54 30.48,3.62 30.48,14.73 31.5,15.75 31.5,18.92 v32.51,19.94
  Bottom 0.254: SV6.12 26.99,2.86 R20.2 30.8,2.86 31.24,3.3 31.24,5.84 29.84,7.24 R22.1
  Bottom 0.406: v34.29,38.35 34.29,35.88 34.22,35.81 C23.1 34.29,36.26 v34.29,33.27 34.29,31.69 C27.1 34.29,31.62 v34.29,28.96 34.29,27.24 arc-90 C21.1 34.29,27.18 34.29,24.77 C22.1 34.22,23.94 32.51,22.23 v32.51,19.94
  pour Top: 25.4,3.81 43.18,3.81 43.18,0 25.4,0
BVREF
  Top 0.254: SV7.2 38.61,8.38 38.61,17.27 36.07,19.81 36.07,26.08 IC2.25
BVSS  (via drill 0.5)
  Top 0.254: IC2.8 31.45,33.53 32.51,33.53 v33.02,34.04 | v33.02,29.46 33.4,29.08 33.4,27.68 IC2.23 | IC2.47 36.58,37.22 v36.58,38.35
  Top 0.406: SV15.3 SV15.5 36.96,9.02 36.96,11.3 SV15.9
  pour Bottom: 25.4,55.88 43.18,55.88 43.18,0 25.4,0
E6
  Top 0.254: IC3.6 46.99,27.53 SV5.5
E7
  Top 0.254: IC3.7 47.99,25.4 SV5.6
E8
  Top 0.254: IC3.8 48.63,23.62 47.75,23.62 SV5.7
E9
  Top 0.254: IC3.9 48.62,19.56 47.75,19.56 SV10.1
E10
  Top 0.254: IC3.10 47.97,17.78 SV10.2
E11
  Top 0.254: IC3.11 46.99,15.67 SV10.3
E12
  Top 0.254: IC3.12 48.26,15.81 48.26,13.97 SV10.4
E13
  Top 0.254: SV10.5 49.02,12.19 49.02,15.44 IC3.13
E14
  Top 0.254: SV10.6 49.78,10.41 49.78,15.07 IC3.14
E15
  Top 0.254: SV10.7 50.55,8.64 50.55,14.7 IC3.15
E18
  Top 0.254: IC3.18 59.44,13.94 59.44,7.87 SV11.2
E19
  Top 0.254: IC3.19 59.94,14.56 59.94,9.91 SV11.3
E20
  Top 0.254: IC3.20 60.45,15.18 60.45,11.94 SV11.4
E21
  Top 0.254: IC3.21 60.96,15.81 60.96,13.97 SV11.5
E22
  Top 0.254: IC3.22 62.23,15.67 SV11.6
E28
  Top 0.254: IC3.28 60.45,26.87 60.45,28.7 SV9.4
E29
  Top 0.254: IC3.29 59.69,27.24 59.69,30.48 SV9.5
E30
  Top 0.254: IC3.30 58.93,27.61 58.93,32.26 SV9.6
EBOOT
  Top 0.254: IC3.31 58.17,27.97 58.17,35.31 58.93,36.07 58.93,37.85 58.17,38.61 50.04,38.61 SV5.2
  Bottom 0.305: R31.1 48.01,34.54 SV5.2
ERST
  Top 0.254: SV14.10 54.61,13.97 54.61,22.16 IC3.4 49.53,27.24 49.53,30.48 SV5.3 53.34,33.02 J3.P$2
  Bottom 0.254: 57.15,34.61 C35.2 | SV14.10 50.48,12.7 R32.2
  Bottom 0.305: J3.P$2 57.15,34.61
ETCK
  Top 0.254: IC3.24 60.6,19.56 61.47,19.56 SV11.8
  Bottom 0.254: SV14.4 54.61,3.81 56.64,3.81 60.2,7.37 60.2,18.29 SV11.8
ETDI
  Top 0.254: IC3.25 60.6,23.62 61.47,23.62 SV9.1
  Bottom 0.254: SV14.8 52.07,8.89 52.07,6.86 52.58,6.35 56.64,6.35 59.69,9.4 59.69,20.32 SV9.1
ETDO
  Top 0.254: IC3.26 61.25,25.4 SV9.2
  Bottom 0.254: SV14.6 54.61,8.89 56.64,8.89 59.18,11.43 59.18,22.35 SV9.2
ETMS
  Top 0.254: IC3.23 59.05,19.95 61.21,17.78 SV11.7
  Bottom 0.254: SV14.2 54.61,1.27 56.64,1.27 60.71,5.33 60.71,16.26 SV11.7
ETRST
  Top 0.254: IC3.27 62.23,27.51 SV9.3
  Bottom 0.254: SV14.7 58.67,12.95 58.67,24.38 SV9.3
EVDD  (via drill 0.5)
  Top 0.254: SV11.1 58.42,2.54 SV14.1
  Top 0.406: 58.42,2.54 58.42,12.83 v56.13,15.11 56.13,16.11 IC3.17 | v53.09,28.19 53.09,27.07 IC3.1
  Bottom 0.254: R32.1 50.16,5.71 SV10.8
  Bottom 0.406: v56.13,15.11 55.56,15.69 C30.1 C32.1 R30.2 C31.1 55.56,26.99 54.36,28.19 v53.09,28.19
  pour Top: 45.72,3.81 63.5,3.81 63.5,0 45.72,0
EVDDA  (via drill 0.5)
  Top 0.254: v52.32,23.11 52.32,23.31 IC3.5 48.77,26.87 48.77,28.7 SV5.4
  Bottom 0.254: R30.1 v52.32,23.11
EVSS  (via drill 0.5)
  Top 0.406: SV14.3 SV14.5 57.4,9.14 57.4,11.18 SV14.9 | v56.13,28.19 56.13,27.07 IC3.32 | IC3.16 53.09,16.11 v53.09,15.11
  pour Bottom: 45.72,40.64 63.5,40.64 63.5,0 45.72,0
N$4
  Bottom 0.305: SV16.19 R42.2
N$5
  Bottom 0.305: SV16.17 56.83,47.62 R41.2
N$6
  Bottom 0.305: SV16.11 58.1,55.24 R40.2
N$10
  Top 0.305: SV16.15 L6.2
N$11
  Top 0.305: SV16.13 L5.2
N$13
  Top 0.305: SV16.9 55.88,60.33 L4.2
N$17
  Top 0.254: IC2.5 29.21,37.89 29.21,44.45 30.99,46.23 33.51,46.23 Q2.1
  Bottom 0.254: Q2.1 37.53,48.26 C24.2
N$22
  Top 0.254: IC2.6 28.7,37.69 28.7,44.96 32,48.26 Q2.2
  Bottom 0.254: 33.12,48.26 Q2.2 31.05,48.26 C25.2
N$24
  Top 0.305: SV16.7 55.88,62.87 L3.2
N$26
  Top 0.254: IC2.3 30.23,38.29 30.23,39.88 30.66,40.31 Q21.1
N$27
  Top 0.254: IC2.4 29.72,38.09 29.72,42.93 30.3,43.51 Q21.4
N$29
  Bottom 0.305: L2.2 55.46,59.91 SV16.5
N$36
  Top 0.305: SV16.3 L1.2
N$39
  Top 0.254: IC3.3 51.31,26.59 51.31,29.21 53.09,30.99 Q3.1
  Bottom 0.254: Q3.1 51.37,30.99 C34.2
N$44
  Top 0.254: IC3.2 52.07,26.96 52.07,28.7 52.83,29.46 54.34,29.46 Q3.2
  Bottom 0.254: Q3.2 57.85,30.99 C33.2
N$69  (via drill 0.5)
  Top 0.254: 8.76,51.82 Q11.1 8.13,51.19 v8.13,49.78 8.13,45.29 IC1.3
  Bottom 0.254: C15.2 v8.13,49.78
N$70  (via drill 0.5)
  Top 0.254: IC1.4 7.11,45.6 v7.11,53.34 7.11,54.1 7.95,54.94 Q11.4
  Bottom 0.254: C14.2 v7.11,53.34
N$71
  Top 0.254: IC1.5 6.1,45.91 6.1,54.86 9.14,57.91 10.9,57.91 Q1.1
  Bottom 0.254: Q1.1 14.67,59.69 C2.2
N$72
  Top 0.254: IC1.6 5.08,46.22 RQ.2
N$78
  Top 0.254: RQ.1 5.91,59.69 Q1.2
  Bottom 0.254: Q1.2 8.19,59.69 C3.2

### Text on the board
tNames: GND | GND | STM32 / Development / Boards / (C) Mikhail Kulesh | JTAG Adapter | L1-6 | BT | 59 | 61 | 58 | 62 | 57 | mikhail.kulesh@ / gmail.com | 2 | 56 | 7 | 55 | 8 | 54 | GND | GND | 9 | 53 | BT | 43 | 10 | 52 | 45 | 42 | 11 | 51 | 46 | 41 | 14 | 50 | 2 | 40 | 15 | 49 | 7 | 39 | GND | GND | 16 | 46 | 10 | 38 | 17 | 45 | 11 | 37 | BT | 30 | 12 | 36 | 20 | 44 | 4 | 29 | 21 | 43 | 5 | 28 | 13 | 35 | 22 | 42 | 14 | 34 | 6 | 27 | 23 | 41 | 15 | 33 | 7 | 26 | 8 | 25 | 24 | 40 | 16 | 32 | 25 | 39 | 17 | 31 | 9 | 24 | 26 | 38 | 18 | 30 | 10 | 23 | 27 | 37 | 19 | 29 | 11 | 22 | 28 | 36 | 20 | 28 | 12 | 21 | 29 | 35 | 21 | 27 | 13 | 20 | 30 | 34 | 22 | 26 | 14 | 19 | VBAT | 33 | VBT | 25 | 15 | 18 | VDD | VDD | VDD | VDD | VDD | VDD